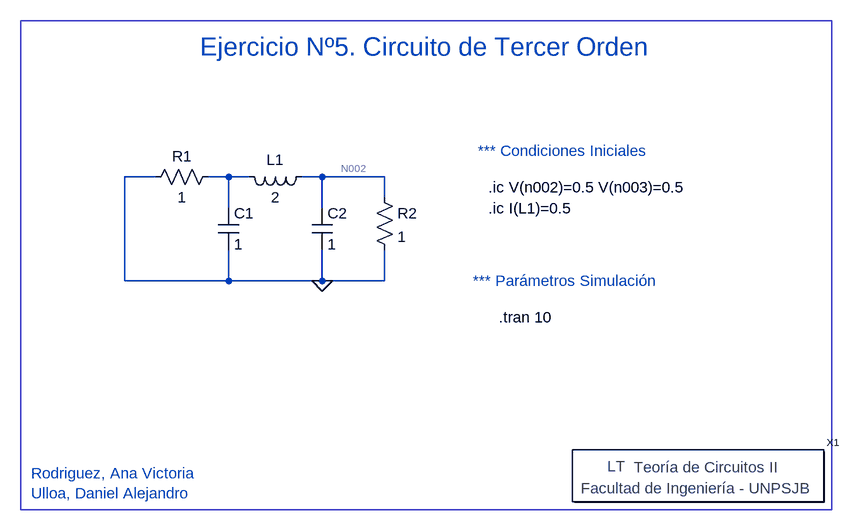
[diagram p0: schematic 05.asc]
05.asc, the LTspice schematic file:
Version 4
SHEET 1 980 680
WIRE -64 -16 -112 -16
WIRE 48 -16 16 -16
WIRE 80 -16 48 -16
WIRE 192 -16 160 -16
WIRE 288 -16 192 -16
WIRE 288 16 288 -16
WIRE 48 32 48 -16
WIRE 192 32 192 -16
WIRE -112 144 -112 -16
WIRE 48 144 48 96
WIRE 48 144 -112 144
WIRE 192 144 192 96
WIRE 192 144 48 144
WIRE 288 144 288 96
WIRE 288 144 192 144
FLAG 192 144 0
SYMBOL Circuitos2\\Letreros\\Teoría\ de\ Circuitos\ II 768 448 R0
SYMATTR InstName X1
SYMBOL res 32 -32 R90
WINDOW 0 0 56 VBottom 2
WINDOW 3 32 56 VTop 2
SYMATTR InstName R1
SYMATTR Value 1
SYMBOL cap 32 32 R0
SYMATTR InstName C1
SYMATTR Value 1
SYMBOL ind 176 -32 R90
WINDOW 0 5 56 VBottom 2
WINDOW 3 32 56 VTop 2
SYMATTR InstName L1
SYMATTR Value 2
SYMBOL cap 176 32 R0
SYMATTR InstName C2
SYMATTR Value 1
SYMBOL res 272 0 R0
SYMATTR InstName R2
SYMATTR Value 1
TEXT 464 200 Left 2 !.tran 10
TEXT 448 0 Left 2 !.ic V(n002)=0.5 V(n003)=0.5
TEXT 448 32 Left 2 !.ic I(L1)=0.5
TEXT 352 -216 Center 4 ;Ejercicio Nº5. Circuito de Tercer Orden
TEXT -256 440 Left 2 ;Rodriguez, Ana Victoria\nUlloa, Daniel Alejandro
TEXT 432 -56 Left 2 ;*** Condiciones Iniciales
TEXT 424 144 Left 2 ;*** Parámetros Simulación
RECTANGLE Normal 976 496 -272 -256

The netlist it stands for:
* 05.asc
XX1 Teoría de Circuitos II
R1 N001 0 1
C1 N001 0 1
L1 N002 N001 2
C2 N002 0 1
R2 N002 0 1
.tran 10
.ic V(n002)=0.5 V(n003)=0.5
.ic I(L1)=0.5
* Ejercicio Nº5. Circuito de Tercer Orden
* Rodriguez, Ana Victoria
* Ulloa, Daniel Alejandro
* *** Condiciones Iniciales
* *** Parámetros Simulación
.backanno
.end